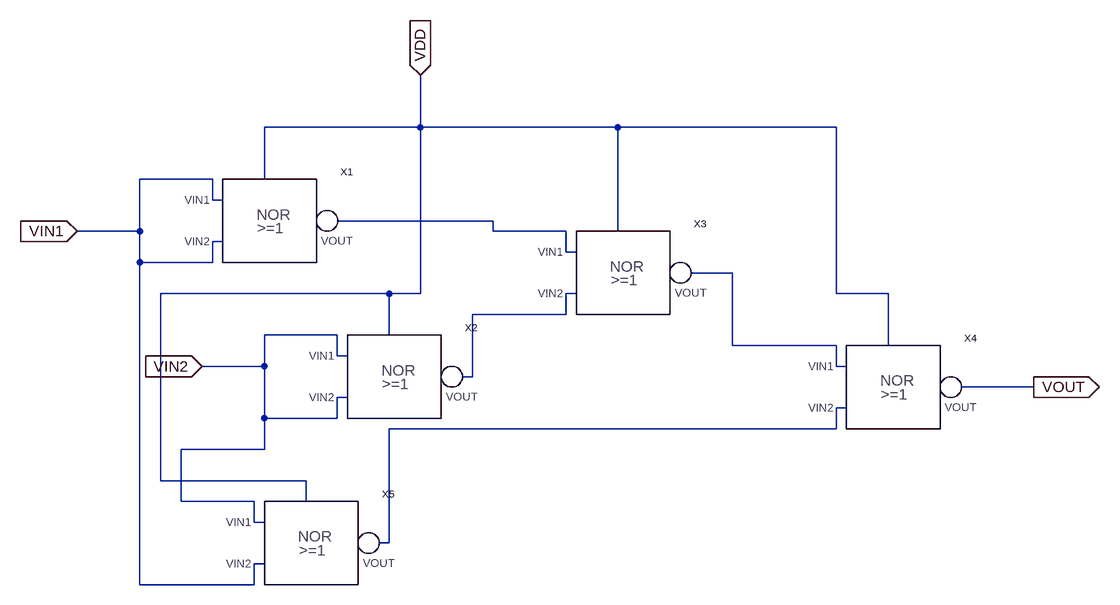
[diagram p0: schematic xor.asc]
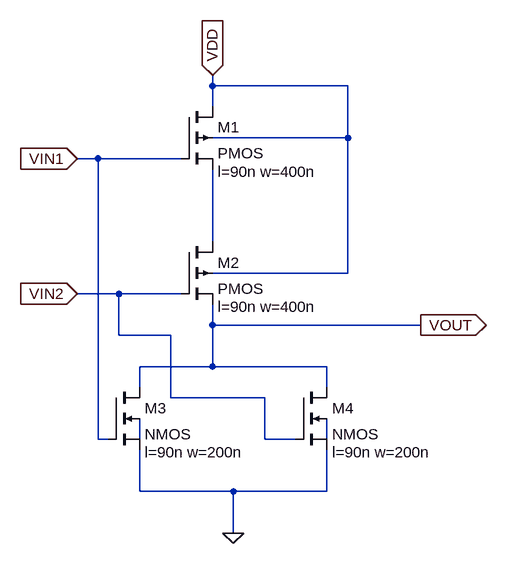
[diagram p1: sub-circuit nor.asc]
xor.asc, the LTspice schematic file:
Version 4
SHEET 1 1624 716
WIRE 592 -32 592 -112
WIRE 592 -32 352 -32
WIRE 896 -32 592 -32
WIRE 1232 -32 896 -32
WIRE 272 48 160 48
WIRE 352 48 352 -32
WIRE 272 80 272 48
WIRE 288 80 272 80
WIRE 704 112 464 112
WIRE 160 128 160 48
WIRE 160 128 64 128
WIRE 704 128 704 112
WIRE 816 128 704 128
WIRE 896 128 896 -32
WIRE 288 144 272 144
WIRE 816 160 816 128
WIRE 832 160 816 160
WIRE 160 176 160 128
WIRE 272 176 272 144
WIRE 272 176 160 176
WIRE 1072 192 1008 192
WIRE 544 224 192 224
WIRE 592 224 592 -32
WIRE 592 224 544 224
WIRE 832 224 816 224
WIRE 1232 224 1232 -32
WIRE 1312 224 1232 224
WIRE 816 256 816 224
WIRE 816 256 672 256
WIRE 464 288 352 288
WIRE 544 288 544 224
WIRE 1072 304 1072 192
WIRE 1232 304 1072 304
WIRE 1312 304 1312 224
WIRE 464 320 464 288
WIRE 480 320 464 320
WIRE 352 336 352 288
WIRE 352 336 256 336
WIRE 1232 336 1232 304
WIRE 1248 336 1232 336
WIRE 672 352 672 256
WIRE 672 352 656 352
WIRE 1536 368 1424 368
WIRE 480 384 464 384
WIRE 1248 400 1232 400
WIRE 352 416 352 336
WIRE 464 416 464 384
WIRE 464 416 352 416
WIRE 1232 432 1232 400
WIRE 1232 432 544 432
WIRE 352 464 352 416
WIRE 352 464 224 464
WIRE 192 512 192 224
WIRE 416 512 192 512
WIRE 224 544 224 464
WIRE 336 544 224 544
WIRE 416 544 416 512
WIRE 336 576 336 544
WIRE 352 576 336 576
WIRE 544 608 544 432
WIRE 544 608 528 608
WIRE 352 640 336 640
WIRE 160 672 160 176
WIRE 336 672 336 640
WIRE 336 672 160 672
FLAG 64 128 VIN1
IOPIN 64 128 In
FLAG 256 336 VIN2
IOPIN 256 336 In
FLAG 1536 368 VOUT
IOPIN 1536 368 Out
FLAG 592 -112 VDD
IOPIN 592 -112 In
SYMBOL nor 272 80 R0
SYMATTR InstName X1
SYMBOL nor 464 320 R0
SYMATTR InstName X2
SYMBOL nor 816 160 R0
SYMATTR InstName X3
SYMBOL nor 1232 336 R0
SYMATTR InstName X4
SYMBOL nor 336 576 R0
SYMATTR InstName X5

nor.asc, the sub-circuit schematic file:
Version 4
SHEET 1 880 680
WIRE -32 -64 -32 -80
WIRE 176 -64 -32 -64
WIRE -32 -32 -32 -64
WIRE 176 16 176 -64
WIRE 176 16 -32 16
WIRE -208 48 -240 48
WIRE -80 48 -208 48
WIRE -32 176 -32 64
WIRE 176 224 176 16
WIRE 176 224 -32 224
WIRE -176 256 -240 256
WIRE -80 256 -176 256
WIRE -32 304 -32 272
WIRE 288 304 -32 304
WIRE -176 320 -176 256
WIRE -96 320 -176 320
WIRE -32 368 -32 304
WIRE -32 368 -144 368
WIRE 144 368 -32 368
WIRE -144 400 -144 368
WIRE 144 400 144 368
WIRE -96 416 -96 320
WIRE 48 416 -96 416
WIRE -208 480 -208 48
WIRE -192 480 -208 480
WIRE -144 480 -144 448
WIRE 48 480 48 416
WIRE 96 480 48 480
WIRE 144 480 144 448
WIRE -144 560 -144 496
WIRE 0 560 -144 560
WIRE 144 560 144 496
WIRE 144 560 0 560
WIRE 0 624 0 560
FLAG -32 -80 VDD
IOPIN -32 -80 In
FLAG -240 48 VIN1
IOPIN -240 48 In
FLAG -240 256 VIN2
IOPIN -240 256 In
FLAG 288 304 VOUT
IOPIN 288 304 Out
FLAG 0 624 0
SYMBOL pmos4 -80 -32 R0
WINDOW 123 56 100 Left 2
SYMATTR Value2 l=90n w=400n
SYMATTR InstName M1
SYMBOL pmos4 -80 176 R0
WINDOW 123 56 100 Left 2
SYMATTR Value2 l=90n w=400n
SYMATTR InstName M2
SYMBOL nmos4 -192 400 R0
WINDOW 123 56 100 Left 2
SYMATTR Value2 l=90n w=200n
SYMATTR InstName M3
SYMBOL nmos4 96 400 R0
WINDOW 123 56 100 Left 2
SYMATTR Value2 l=90n w=200n
SYMATTR InstName M4

The netlist it stands for:
* xor.asc
XX1 VIN1 VIN1 N001 VDD nor
XX2 VIN2 VIN2 N003 VDD nor
XX3 N001 N003 N002 VDD nor
XX4 N002 N004 VOUT VDD nor
XX5 VIN2 VIN1 N004 VDD nor

* block symbol definitions
.subckt nor VIN1 VIN2 VOUT VDD
M1 VDD VIN1 N001 VDD PMOS l=90n w=400n
M2 N001 VIN2 VOUT VDD PMOS l=90n w=400n
M3 VOUT VIN1 0 N002 NMOS l=90n w=200n
M4 VOUT VIN2 0 N003 NMOS l=90n w=200n
.ends nor

.model NMOS NMOS
.model PMOS PMOS
.lib standard.mos
.backanno
.end